# EAGLE design rf-gateway (EAGLE 9.6.2)
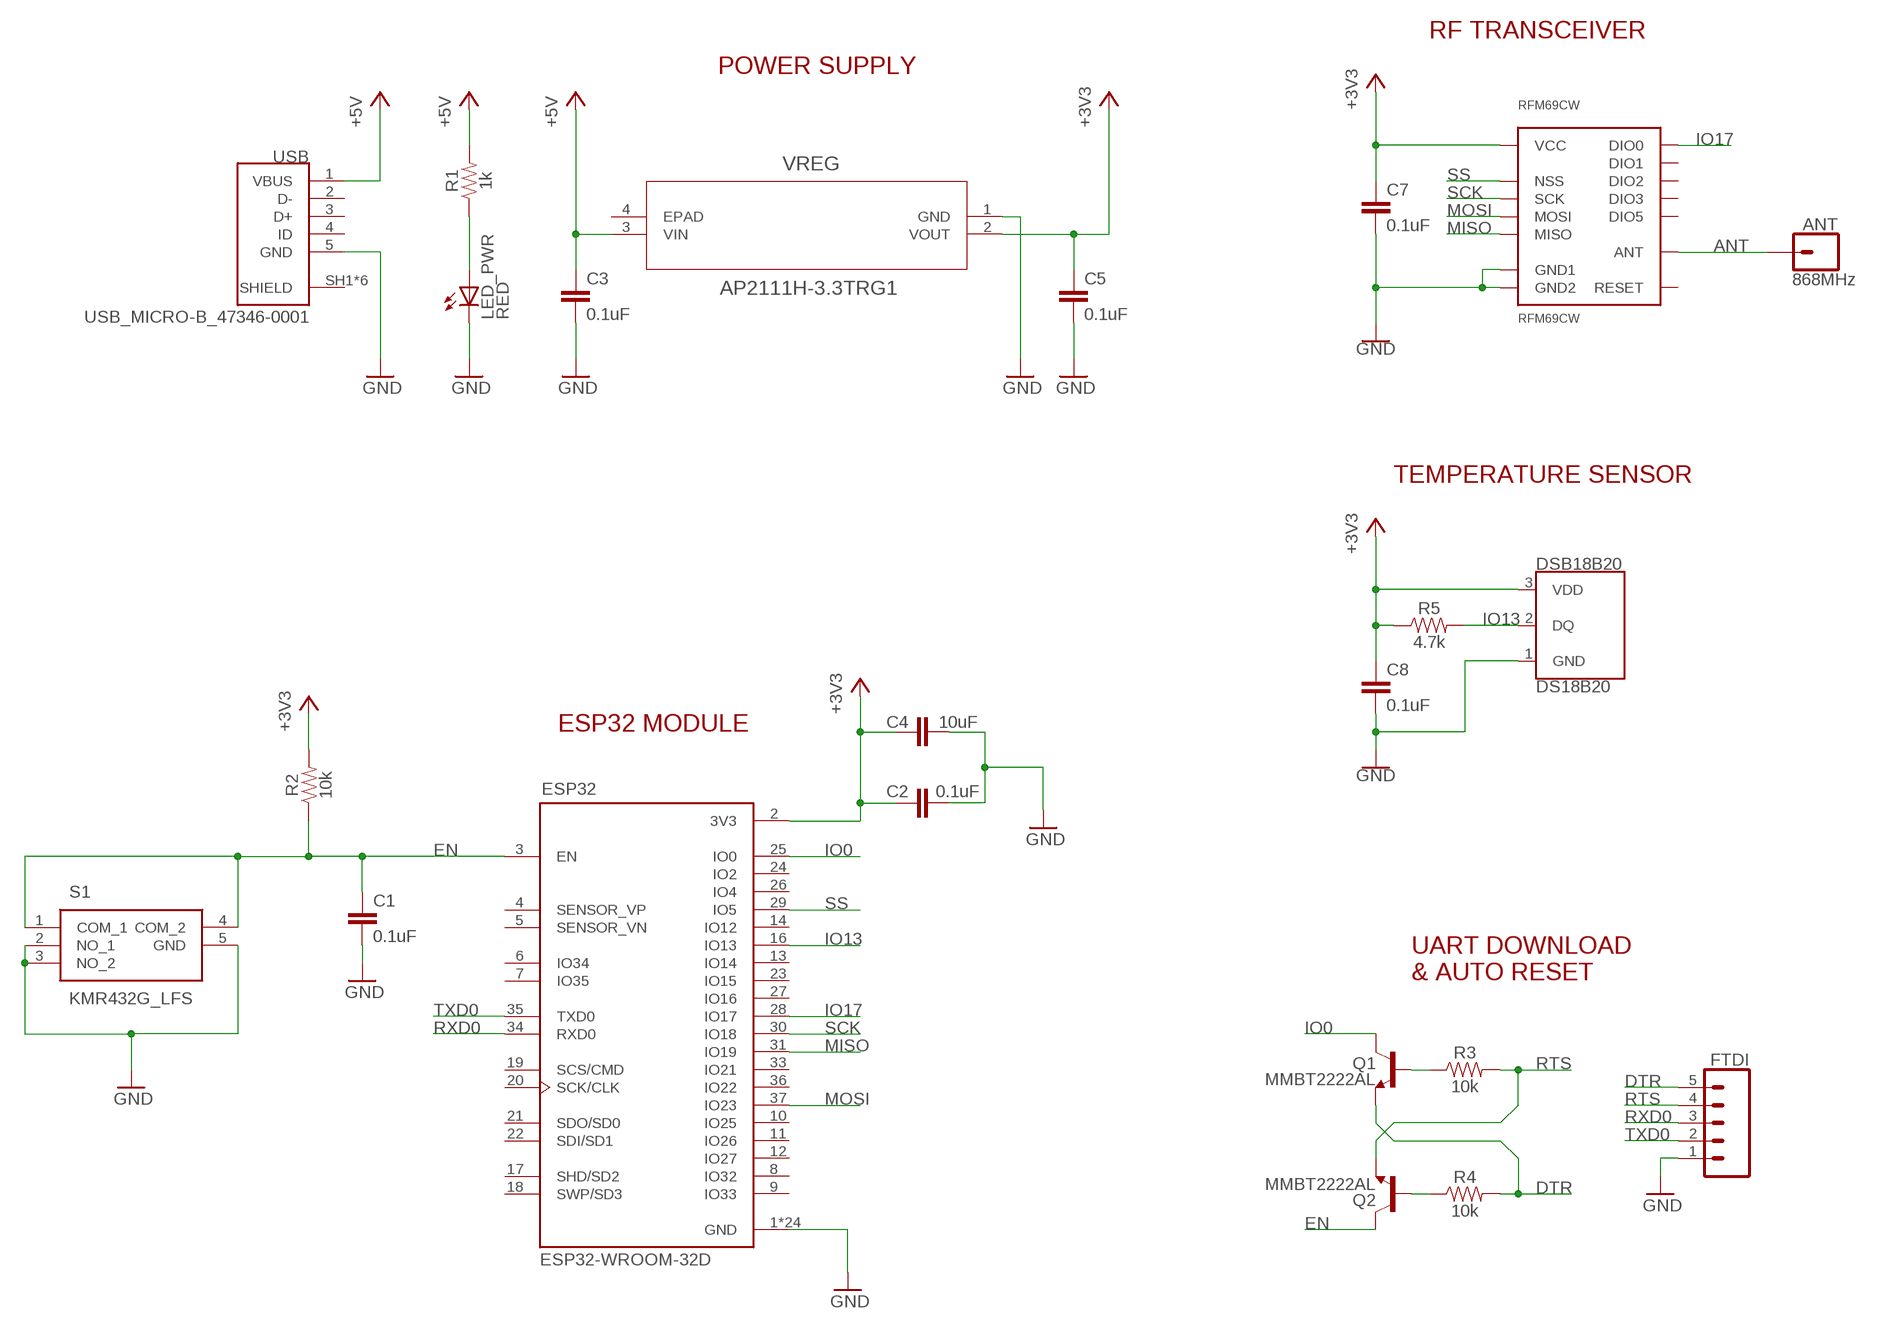
[diagram p0: schematic, sheet 1]

## Parts
ANT  868MHz  CONN_01  [1X01]
C1  0.1uF  0.1UF-0603-25V-5%  [0603]
C2  0.1uF  0.1UF-0603-25V-5%  [0603]
C3  0.1uF  0.1UF-0603-25V-5%  [0603]
C4  10uF  10UF-0805-10V-10%  [0805]
C5  0.1uF  0.1UF-0603-25V-5%  [0603]
C7  0.1uF  0.1UF-0603-25V-5%  [0603]
C8  0.1uF  0.1UF-0603-25V-5%  [0603]
DSB18B20  DS18B20  [TO-92-AMMO]
ESP32  ESP32-WROOM-32D  [ESP32-WROOM-32D]
FTDI  CONN_05  [1X05]
LED_PWR  RED  LEDCHIPLED_0805  [CHIPLED_0805]
Q1  MMBT2222AL  TRANS_NPN-MMBT2222AL  [SOT23-3]
Q2  MMBT2222AL  TRANS_NPN-MMBT2222AL  [SOT23-3]
R1  1k  1KOHM-0603-1/10W-1%  [0603]
R2  10k  10KOHM-0603-1/10W-1%  [0603]
R3  10k  10KOHM-0603-1/10W-1%  [0603]
R4  10k  10KOHM-0603-1/10W-1%  [0603]
R5  4.7k  4.7KOHM-0603-1/10W-1%  [0603]
RFM69CW  RFM69CW  [RFM69CW]
S1  KMR432G_LFS  [KMR421GULCLFS]
USB  USB_MICRO-B_47346-0001  [MOLEX_47346-0001]
VREG  AP2111H-3.3TRG1  [SOT-223_DIO]

## Nets
+3V3: C2.1 C4.1 C5.1 C7.1 C8.1 DSB18B20.3(VDD) ESP32.2(3V3) R2.2 R5.1 RFM69CW.VDD(VCC) VREG.2(VOUT)
+5V: C3.1 R1.2 USB.1(VBUS) VREG.3(VIN)
ANT: ANT.1 RFM69CW.ANT
DTR: FTDI.5 Q1.2(E) R4.2
EN: C1.1 ESP32.3(EN) Q2.3(C) R2.1 S1.1(COM_1) S1.4(COM_2)
GND: C1.2 C2.2 C3.2 C4.2 C5.2 C7.2 C8.2 DSB18B20.1(GND) ESP32.1(GND) ESP32.15(GND) ESP32.38(GND) ESP32.39_1(GND) ESP32.39_2(GND) ESP32.39_3(GND) ESP32.39_4(GND) ESP32.39_5(GND) ESP32.39_6(GND) ESP32.39_7(GND) ESP32.39_8(GND) ESP32.39_9(GND) ESP32.39_10(GND) ESP32.39_11(GND) ESP32.39_12(GND) ESP32.39_13(GND) ESP32.39_14(GND) ESP32.39_15(GND) ESP32.39_16(GND) ESP32.39_17(GND) ESP32.39_18(GND) ESP32.39_19(GND) ESP32.39_20(GND) ESP32.39_21(GND) FTDI.1 LED_PWR.C RFM69CW.GND@1(GND1) RFM69CW.GND@2(GND2) S1.2(NO_1) S1.3(NO_2) S1.5(GND) USB.5(GND) VREG.1(GND)
IO0: ESP32.25(IO0) Q1.3(C)
IO13: DSB18B20.2(DQ) ESP32.16(IO13) R5.2
IO17: ESP32.28(IO17) RFM69CW.DIO0
MISO: ESP32.31(IO19) RFM69CW.MISO
MOSI: ESP32.37(IO23) RFM69CW.MOSI
N$1: LED_PWR.A R1.1
N$2: Q1.1(B) R3.1
N$3: Q2.1(B) R4.1
RTS: FTDI.4 Q2.2(E) R3.2
RXD0: ESP32.34(RXD0) FTDI.3
SCK: ESP32.30(IO18) RFM69CW.SCK
SS: ESP32.29(IO5) RFM69CW.NSS
TXD0: ESP32.35(TXD0) FTDI.2
Unconnected: ESP32.4(SENSOR_VP) ESP32.5(SENSOR_VN) ESP32.6(IO34) ESP32.7(IO35) ESP32.8(IO32) ESP32.9(IO33) ESP32.10(IO25) ESP32.11(IO26) ESP32.12(IO27) ESP32.13(IO14) ESP32.14(IO12) ESP32.17(SHD/SD2) ESP32.18(SWP/SD3) ESP32.19(SCS/CMD) ESP32.20(SCK/CLK) ESP32.21(SDO/SD0) ESP32.22(SDI/SD1) ESP32.23(IO15) ESP32.24(IO2) ESP32.26(IO4) ESP32.27(IO16) ESP32.33(IO21) ESP32.36(IO22) RFM69CW.DIO1 RFM69CW.DIO2 RFM69CW.DIO3 RFM69CW.DIO5 RFM69CW.RESET USB.2(D-) USB.3(D+) USB.4(ID) USB.SH1(SHIELD) USB.SH2(SHIELD) USB.SH3(SHIELD) USB.SH4(SHIELD) USB.SH5(SHIELD) USB.SH6(SHIELD) VREG.4(EPAD)

## Notes on the sheet
- RF TRANSCEIVER
- POWER SUPPLY
- TEMPERATURE SENSOR
- ESP32 MODULE
- UART DOWNLOAD
  & AUTO RESET

## Library data of the parts
ANT = SparkFun-Connectors:CONN_01: Single connection point. Often used as Generic Header-pin footprint for 0.1 inch spaced/style header connections On any of the 0.1 inch spaced packages, you can populate with these: Break Away Headers - Straight <https://www.sparkfun.com/products/116> (PRT-00116) Break Away Male Headers - Right Angle <https://www.sparkfun.com/products/553> (PRT-00553) Female Headers <https://www.sparkfun.com/products/115> (PRT-00115) Break Away Headers - Machine Pin <https://www.sparkfun.com/products/117> (PRT-00117) Break Away Female Headers - Swiss Machine Pin <https://www.sparkfun.com/products/743> (PRT-00743) This device is also useful as a general connection point to wire up your design to another part of your project. Our various solder wires solder well into these plated through hole pads. Hook-Up Wire - Assortment (Stranded, 22 AWG) <https://www.sparkfun.com/products/11375> (PRT-11375) Hook-Up Wire - Assortment (Solid Core, 22 AWG) <https://www.sparkfun.com/products/11367> (PRT-11367) View the entire wire category on our website here <https://www.sparkfun.com/categories/141> Special notes: SMTSO-256-ET is a "flush mount" nut for a 4-40 screw. We mostly use this on specialty testbeds; it is a nice way to connect hardware to your PCB at an adjustable hieght. Also note, the SNAP packages are for using a snappable style connector. We sell a baggie of snaps and they are also used on two LilyPad designs: Snap Assortment - 30 pack (male and female) <https://www.sparkfun.com/products/11347> (DEV-11347) LilyPad Arduino SimpleSnap <https://www.sparkfun.com/products/10941> (DEV-10941) LilyPad SimpleSnap Protoboard <https://www.sparkfun.com/products/10940> (DEV-10940)
C1-C3 C5 C7 C8 = SparkFun-Capacitors:0.1UF: 0.1µF ceramic capacitors A capacitor is a passive two-terminal electrical component used to store electrical energy temporarily in an electric field.; PROD_ID: CAP-08604
C4 = SparkFun-Capacitors:10UF: 10.0µF ceramic capacitors A capacitor is a passive two-terminal electrical component used to store electrical energy temporarily in an electric field.; PROD_ID: CAP-11330
DSB18B20 = SparkFun-Sensors:DS18B20: Dallas/Maxim DS18B20 1-Wire Temperature Sensor The DS18B20 reports degrees C with 9 to 12-bit precision, -55C to 125C (+/-0.5C). Each sensor has a unique 64-Bit Serial number etched into it - allows for a huge number of sensors to be used on one data bus. Datasheet <http://datasheets.maximintegrated.com/en/ds/DS18B20.pdf> SparkFun Products One Wire Digital Temperature Sensor - DS18B20 <https://www.sparkfun.com/products/245> (SEN-00245); STORE_ID: SEN-00245
ESP32 = IC-Microcontroller:ESP32-WROOM-32D: Bluetooth, WiFi 802.11b/g/n, Bluetooth v4.2 + EDR, Class 1, 2 and 3 Transceiver Module 2.4GHz ~ 2.5GHz Integrated, Trace Surface Mount; AVAILABILITY: Unavailable; DESCRIPTION: Bluetooth, WiFi 802.11b/g/n, Bluetooth v4.2 + EDR, Class 1, 2 and 3 Transceiver Module 2.4GHz ~ 2.5GHz Integrated, Trace Surface Mount; MF: Espressif Systems; MP: ESP32-WROOM-32D; PACKAGE: Module Espressif Systems; PRICE: None
FTDI = SparkFun-Connectors:CONN_05: Multi connection point. Often used as Generic Header-pin footprint for 0.1 inch spaced/style header connections On any of the 0.1 inch spaced packages, you can populate with these: Break Away Headers - Straight <https://www.sparkfun.com/products/116> (PRT-00116) Break Away Male Headers - Right Angle <https://www.sparkfun.com/products/553> (PRT-00553) Female Headers <https://www.sparkfun.com/products/115> (PRT-00115) Break Away Headers - Machine Pin <https://www.sparkfun.com/products/117> (PRT-00117) Break Away Female Headers - Swiss Machine Pin <https://www.sparkfun.com/products/743> (PRT-00743) For SCREWTERMINALS and SPRING TERMINALS visit here: Screw Terimnals on SparkFun.com <https://www.sparkfun.com/search/results?term=Screw+Terminals> (5mm/3.5mm/2.54mm spacing) This device is also useful as a general connection point to wire up your design to another part of your project. Our various solder wires solder well into these plated through hole pads. Hook-Up Wire - Assortment (Stranded, 22 AWG) <https://www.sparkfun.com/products/11375> (PRT-11375) Hook-Up Wire - Assortment (Solid Core, 22 AWG) <https://www.sparkfun.com/products/11367> (PRT-11367) View the entire wire category on our website here <https://www.sparkfun.com/categories/141> Special notes: Molex polarized connector foot print use with SKU : PRT-08231 with associated crimp pins and housings. 1MM SMD Version SKU: PRT-10208
LED_PWR = adafruit:LED: LED OSRAM: - CHIPLED LG R971, LG N971, LY N971, LG Q971, LY Q971, LO R971, LY R971 LH N974, LH R974 LS Q976, LO Q976, LY Q976 LO Q996 - Hyper CHIPLED LW Q18S LB Q993, LB Q99A, LB R99A - SideLED LS A670, LO A670, LY A670, LG A670, LP A670 LB A673, LV A673, LT A673, LW A673 LH A674 LY A675 LS A676, LA A676, LO A676, LY A676, LW A676 LS A679, LY A679, LG A679 - Hyper Micro SIDELED® LS Y876, LA Y876, LO Y876, LY Y876 LT Y87S - SmartLED LW L88C, LW L88S LB L89C, LB L89S, LG L890 LS L89K, LO L89K, LY L89K LS L896, LA L896, LO L896, LY L896 - TOPLED LS T670, LO T670, LY T670, LG T670, LP T670 LSG T670, LSP T670, LSY T670, LOP T670, LYG T670 LG T671, LOG T671, LSG T671 LB T673, LV T673, LT T673, LW T673 LH T674 LS T676, LA T676, LO T676, LY T676, LB T676, LH T676, LSB T676, LW T676 LB T67C, LV T67C, LT T67C, LS T67K, LO T67K, LY T67K, LW E67C LS E67B, LA E67B, LO E67B, LY E67B, LB E67C, LV E67C, LT E67C LW T67C LS T679, LY T679, LG T679 LS T770, LO T770, LY T770, LG T770, LP T770 LB T773, LV T773, LT T773, LW T773 LH T774 LS E675, LA E675, LY E675, LS T675 LS T776, LA T776, LO T776, LY T776, LB T776 LHGB T686 LT T68C, LB T68C - Hyper Mini TOPLED® LB M676 - Mini TOPLED Santana® LG M470 LS M47K, LO M47K, LY M47K Source: http://www.osram.convergy.de/
Q1 Q2 = SparkFun-DiscreteSemi:TRANS_NPN: NPN transistor Current controlled devices typically used to amplify current or used as a switch. BC547 - COM-08928 <http://www.sparkfun.com/products/8928> (TO-92 45V 100mA) (1.Collector 2.Base 3.Emitter) 2N3904 - COM-00521 <http://www.sparkfun.com/products/521> (TO-92 40V 200mA) (1.Emitter 2.Base 3.Collector) P2N2222A - COM-12852 <http://www.sparkfun.com/products/12852> (TO-92 40V 600mA) (1.Collector 2.Base 3.Emitter); PROD_ID: TRANS-08049; VALUE: 600mA/40V
R1 = SparkFun-Resistors:1KOHM: 1kΩ resistor A resistor is a passive two-terminal electrical component that implements electrical resistance as a circuit element. Resistors act to reduce current flow, and, at the same time, act to lower voltage levels within circuits. - Wikipedia; PROD_ID: RES-07856
R2-R4 = SparkFun-Resistors:10KOHM: 10kΩ resistor A resistor is a passive two-terminal electrical component that implements electrical resistance as a circuit element. Resistors act to reduce current flow, and, at the same time, act to lower voltage levels within circuits. - Wikipedia; PROD_ID: RES-00824
R5 = SparkFun-Resistors:4.7KOHM: 4.7kΩ resistor A resistor is a passive two-terminal electrical component that implements electrical resistance as a circuit element. Resistors act to reduce current flow, and, at the same time, act to lower voltage levels within circuits. - Wikipedia; PROD_ID: RES-07857
RFM69CW = kanflo:RFM69CW: HopeRFs RFM69CW with all digital IOs available.
S1 = Oyvind:KMR432G_LFS: SWITCH TACTILE SPST-NO 0.05A 32V Source: Datasheet <https://www.mouser.com/datasheet/2/60/kmr4-1382752.pdf>; ARROW_PART_NUMBER: KMR432G LFS; ARROW_PRICE-STOCK: https://www.arrow.com/en/products/kmr432glfs/ck?region=nac; DESCRIPTION: SWITCH TACTILE SPST-NO 0.05A 32V; HEIGHT: 2.5mm; MANUFACTURER_NAME: C & K COMPONENTS; MANUFACTURER_PART_NUMBER: KMR432G LFS; MOUSER_PART_NUMBER: 611-KMR432GLFS
USB = Connectors:USB_MICRO-B_47346-0001: CONN RCPT 5POS MICRO USB R/A SMD; AVAILABILITY: Unavailable; DESCRIPTION: USB - micro B USB 2.0 Receptacle Connector 5 Position Surface Mount, Right Angle; MF: Molex; MOUSER-PURCHASE-URL: https://snapeda.com/shop?store=Mouser&id=53503; MP: 47346-0001; PACKAGE: None; PRICE: None
VREG = IC-Power:AP2111H-3.3TRG1; BUILT_BY: EMA_UL_Team; MANUFACTURER_PART_NUMBER: AP2111H-3.3TRG1; SOURCELIBRARY: DIODESINC_2_2015-08-18; VENDOR: Diodes Inc

## Board
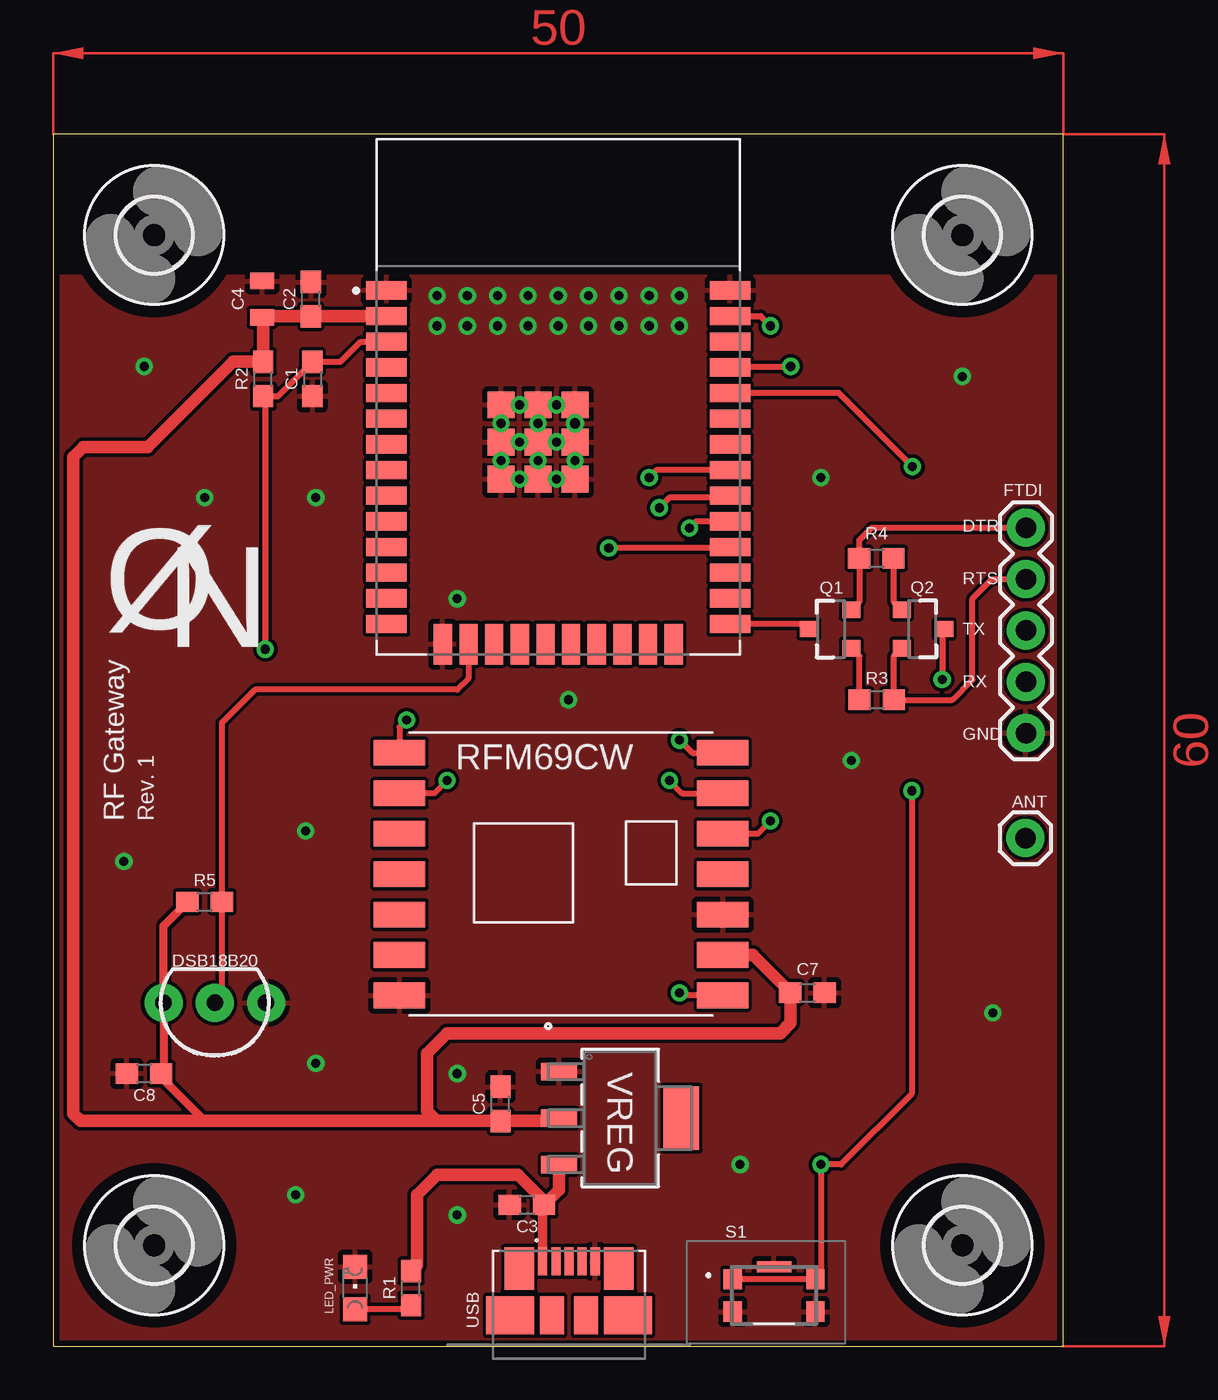
[diagram p1: board, top side]
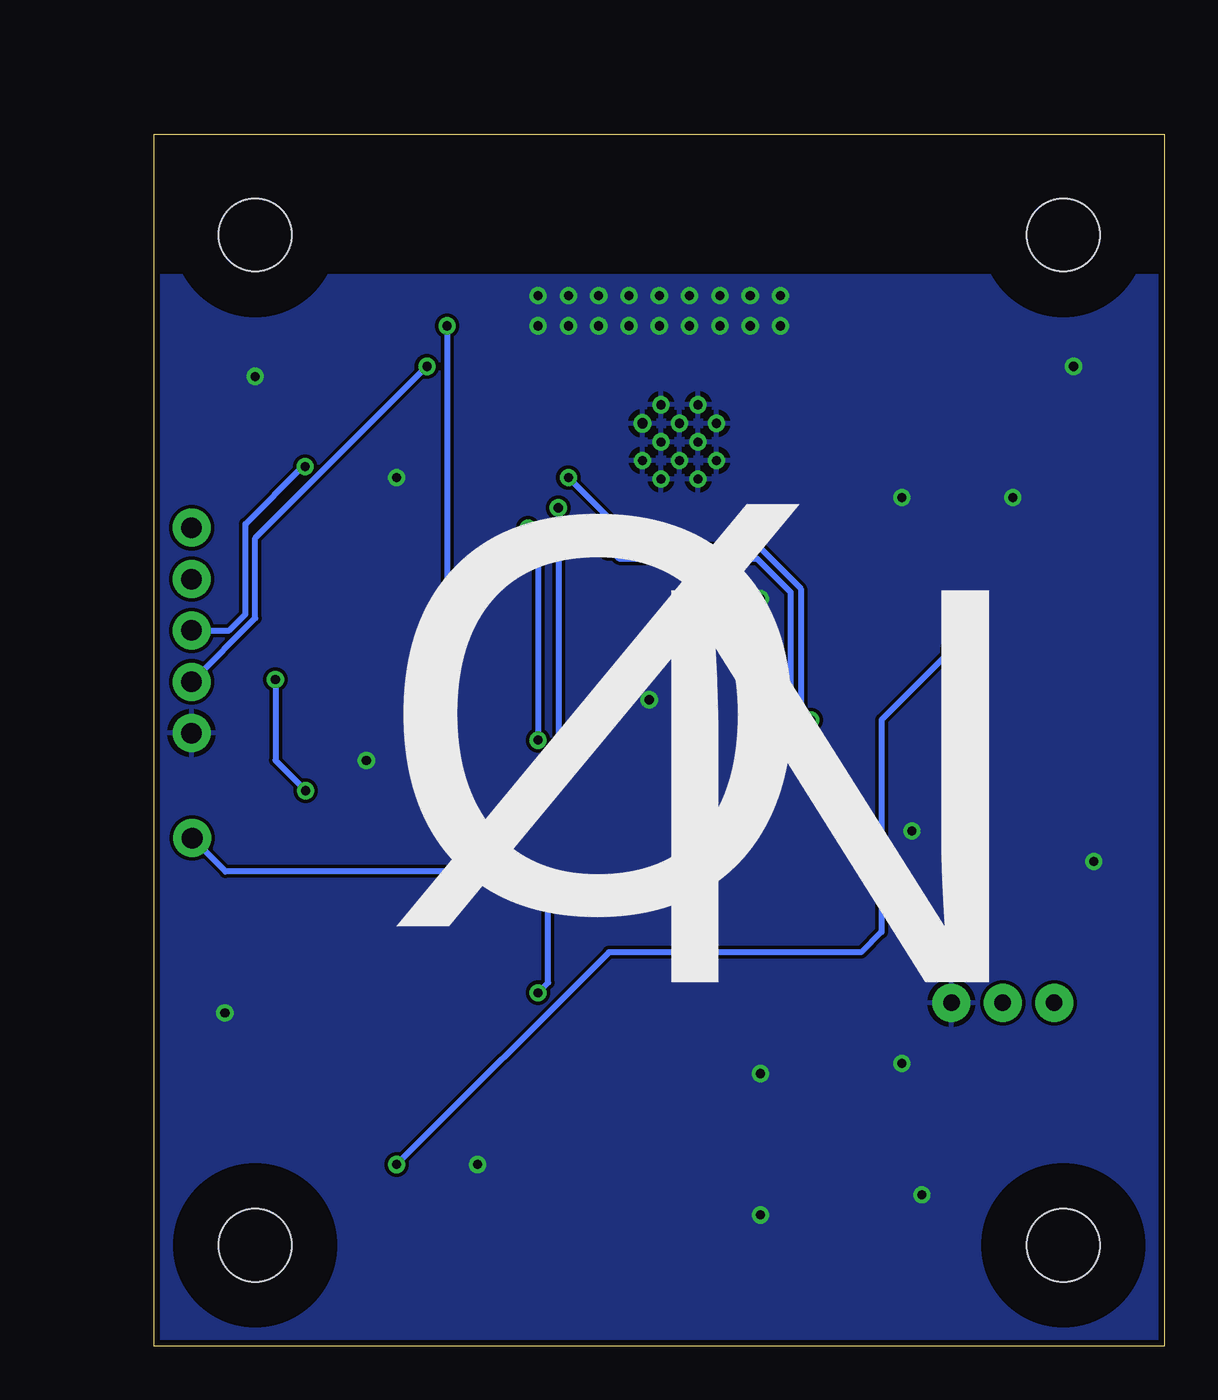
[diagram p2: board, bottom side, seen from below]

Size 50 x 60 mm. Coordinates in mm from the lower left corner, seen from the top.
Outline: 0,0 50,0 50,60 0,60 0,0
Copper layers (1*16): Top 0.035mm / dielectric 1.5mm / Bottom 0.035mm
Design rules "aisler_2_layer_simple": minimum track width 0.2mm, minimum drill 0.45mm, track to track 0.175mm, track to pad 0.175mm, pad to pad 0.175mm, via to via 0.175mm, smd to smd 0.175mm, copper to edge 0.3mm, drill to drill 0.25mm, minimum pad ring 0.2mm, minimum via ring 0.2mm, stop-mask expansion 0mil, vias tented up to drill 0mil, thermal gap 10mil

### Footprints (pad centres in the part's own frame; a part is rotated, then mirrored left to right if it is on the bottom)
1X01 = drill 1.016 pad 1.88: 1 0,0
0603 = smd 1.1 x 1: 1 -0.85,0; 2 0.85,0
0805 = smd 0.8 x 1.2: 1 -0.9,0; 2 0.9,0
TO-92-AMMO = drill 0.813 pad 1.88: 1 -2.54,0; 2 0,0; 3 2.54,0
ESP32-WROOM-32D = smd 2 x 0.9: 1 -8.5,5.26; 2 -8.5,3.99; 3 -8.5,2.72; 4 -8.5,1.45; 5 -8.5,0.18; 6 -8.5,-1.09; 7 -8.5,-2.36; 8 -8.5,-3.63; 9 -8.5,-4.9; 10 -8.5,-6.17; 11 -8.5,-7.44; 12 -8.5,-8.71; 13 -8.5,-9.98; 14 -8.5,-11.25; 25 8.5,-11.25; 26 8.5,-9.98; 27 8.5,-8.71; 28 8.5,-7.44; 29 8.5,-6.17; 30 8.5,-4.9; 31 8.5,-3.63; 32 8.5,-2.36; 33 8.5,-1.09; 34 8.5,0.18; 35 8.5,1.45; 36 8.5,2.72; 37 8.5,3.99; 38 8.5,5.26 | smd 0.9 x 2: 15 -5.715,-12.25; 16 -4.445,-12.25; 17 -3.175,-12.25; 18 -1.905,-12.25; 19 -0.635,-12.25; 20 0.635,-12.25; 21 1.905,-12.25; 22 3.175,-12.25; 23 4.445,-12.25; 24 5.715,-12.25 | smd 1.33 x 1.33: 39_1 -2.835,-0.405; 39_2 -1,-0.405; 39_3 0.835,-0.405; 39_4 -2.835,-2.24; 39_5 -1,-2.24; 39_6 0.835,-2.24; 39_7 -2.835,-4.075; 39_8 -1,-4.075; 39_9 0.835,-4.075 | drill 0.45: 39_10 -1.917,-0.405; 39_11 -0.083,-0.405; 39_12 -2.835,-1.323; 39_13 -1,-1.323; 39_15 -1.917,-2.24; 39_16 -0.083,-2.24; 39_17 -2.835,-3.158; 39_18 -1,-3.158; 39_19 0.835,-3.158; 39_20 -1.917,-4.075; 39_21 -0.083,-4.075 | drill 0.5: 39_14 0.835,-1.323
1X05 = drill 1.016 pad 1.88: 1 0,0; 2 2.54,0; 3 5.08,0; 4 7.62,0; 5 10.16,0
CHIPLED_0805 = smd 1.2 x 1.2: A 0,-1.05; C 0,1.05
SOT23-3 = smd 0.8 x 0.9: 1 -0.95,-1; 2 0.95,-1; 3 0,1.1
RFM69CW = smd 2.54 x 1.27: ANT 8,-6; DIO0 -8,4; DIO1 -8,0; DIO2 -8,2; DIO3 8,0; DIO5 -8,-2; GND@1 8,-2; GND@2 -8,-6; MISO -8,6; MOSI 8,2; NSS 8,6; RESET -8,-4; SCK 8,4; VDD 8,-4
KMR421GULCLFS = smd 0.9 x 1: 1 -2.05,0.8; 2 -2.05,-0.8; 3 2.05,-0.8; 4 2.05,0.8 | smd 1.7 x 0.55: 5 0,1.425
3,6 = hole 3.6: 0,0
MOLEX_47346-0001 = smd 0.45 x 1.38: 1 -1.3,2.66; 2 -0.65,2.66; 3 0,2.66; 4 0.65,2.66; 5 1.3,2.66 | smd 1.475 x 2.1: SH1 -2.462,2.3; SH2 2.462,2.3 | smd 2.375 x 1.9: SH3 -2.913,0; SH6 2.913,0 | smd 1.175 x 1.9: SH4 -0.838,0; SH5 0.838,0
SOT-223_DIO = smd 0.851 x 1.761: 1 -2.3,-3.025; 2 0,-3.025; 3 2.3,-3.025 | smd 3.151 x 1.761: 4 0,3.025

### Placement (x,y rotation side)
ANT  48.12,25.15 0 top
C1  12.83,47.88 270 top
C2  12.76,51.83 90 top
C3  23.45,7 180 top
C4  10.34,51.83 90 top
C5  22.14,12 90 top
C7  37.33,17.5 0 top
C8  4.5,13.5 180 top
DSB18B20  8,17 180 top
ESP32  25,47 0 top
FTDI  48.15,30.35 90 top
LED_PWR  14.94,2.88 0 top
Q1  38.5,35.5 90 top
Q2  43,35.5 270 top
R1  17.71,2.88 90 top
R2  10.4,47.88 90 top
R3  40.76,32 0 top
R4  40.74,39 180 top
R5  7.5,22 0 top
RFM69CW  25.14,23.37 0 top
S1  35.68,2.52 0 top
U$1  [3,6]  5,55 0 top
U$2  [3,6]  45,55 0 top
U$3  [3,6]  45,5 0 top
U$4  [3,6]  5,5 0 top
USB  25.53,1.54 0 top
VREG  28.06,11.3 270 top

### Tracks (layer width: path | path; a pad name or v marks a point on that pad's centre or on a via)
+3V3
  Top 0.406: VREG.2 24.89,11.15 | C2.1 12.78,50.99 | 10.39,50.98 C4.1 10.4,50.87 | 7.5,11.15 5.35,13.3 C8.1 5.46,13.61 DSB18B20.3 5.46,20.81 R5.1 | 36.48,17.52 C7.1 36.5,17.48
  Top 0.61: 24.89,11.15 C5.1 19,11.15 | 19,11.15 7.5,11.15 1.35,11.15 1,11.5 1,44 1.5,44.5 4.67,44.5 8.9,48.73 R2.2 10.4,50.87 | ESP32.2 12.78,50.99 | C2.1 10.39,50.98 | RFM69CW.VDD 34.63,19.37 36.48,17.52 | 36.5,17.48 36.5,16 36,15.5 19.5,15.5 18.5,14.5 18.5,11.65 19,11.15
+5V
  Top 0.406: 18,4.02 R1.2 | C3.1 24.3,7.2
  Top 0.47: USB.1 24.23,6.93
  Top 0.508: 24.23,6.93 C3.1
  Top 0.61: C3.1 25.04,7.74 VREG.3 | 24.3,7.2 23,8.5 19,8.5 18,7.5 18,4.02
ANT  (via drill 0.45)
  Top 0.305: RFM69CW.ANT 31.13,17.37 v31,17.5
  Bottom 0.305: v31,17.5 30.5,18 30.5,22 32,23.5 46.47,23.5 ANT.1
DTR
  Top 0.305: Q1.2 39.89,36.84 R4.2 39.89,39.89 40.51,40.51 FTDI.5
EN  (via drill 0.45)
  Top 0.305: ESP32.3 15.22,49.72 14.22,48.73 C1.1 11.13,47.02 R2.1 10.5,46.92 v10.5,34.5 | S1.1 S1.4 38,3.59 v38,9 39,9 42.5,12.5 v42.5,27.5 | Q2.3 44,35.4 v44,33
  Bottom 0.305: v10.5,34.5 14,31 14,20.5 15,19.5 27.5,19.5 v38,9 | v44,33 44,29 v42.5,27.5
GND  (via drill 0.45)
  other vias: 4.5,48.5 45,48 7.5,42 12.5,25.5 12,7.5 34,9 46.5,16.5 25.5,32 13,42 3.5,24 39.5,29 20,13.5 13,14 20,6.5 38,43 19,52 20,37 31,52 20.5,52 22,52 23.5,52 25,52 26.5,52 28,52 29.5,52 19,50.5 20.5,50.5 22,50.5 23.5,50.5 25,50.5 26.5,50.5 28,50.5 29.5,50.5 31,50.5
  pour Top: 0,53 50,53 50,0 0,0
  pour Bottom: 0,53 50,53 50,0 0,0
IO0
  Top 0.305: Q1.3 37.15,35.75 ESP32.25
IO13
  Top 0.305: ESP32.16 20.55,33.05 20,32.5 10,32.5 8.35,30.85 R5.2 8.35,17.35 DSB18B20.2
IO17  (via drill 0.45)
  Top 0.305: ESP32.28 33.44,39.5 v27.5,39.5 | v19.5,28 18.87,27.37 RFM69CW.DIO0
  Bottom 0.305: v27.5,39.5 27,39 20.18,39 18.5,37.32 18.5,31 19.5,30 v19.5,28
MISO  (via drill 0.45)
  Top 0.305: ESP32.31 29.87,43.37 v29.5,43 | v17.5,31 17.14,30.64 RFM69CW.MISO
  Bottom 0.305: v29.5,43 26,39.5 20,39.5 18,37.5 18,31.5 v17.5,31
MOSI  (via drill 0.45)
  Top 0.305: ESP32.37 35.01,50.99 v35.5,50.5 | v35.5,26 34.87,25.37 RFM69CW.MOSI
  Bottom 0.305: v35.5,50.5 v35.5,26
N$1
  Top 0.305: 17.51,1.83 LED_PWR.A
  Top 0.508: R1.1 17.51,1.83
N$2
  Top 0.305: R3.1 39.91,34.14 Q1.1
N$3
  Top 0.305: R4.1 41.59,36.86 Q2.1
RTS
  Top 0.305: Q2.2 41.61,34.16 R3.2 44.5,32 45.5,33 45.5,37 46.47,37.97 FTDI.4
RXD0  (via drill 0.45)
  Top 0.305: v42.53,43.53 38.88,47.18 ESP32.34
  Bottom 0.305: FTDI.3 46.29,35.43 45.48,36.24 45.48,40.7 42.65,43.53 v42.53,43.53
SCK  (via drill 0.45)
  Top 0.305: ESP32.30 33.4,42 30.5,42 v30,41.5 | v30.5,28 31.13,27.37 RFM69CW.SCK
  Bottom 0.305: v30,41.5 30,28.5 v30.5,28
SS  (via drill 0.45)
  Top 0.305: ESP32.29 31.83,40.83 v31.5,40.5 | v31,30 31.63,29.37 RFM69CW.NSS
  Bottom 0.305: v31.5,40.5 31,40 v31,30
TXD0  (via drill 0.45)
  Top 0.305: v36.5,48.5 36.45,48.45 ESP32.35
  Bottom 0.305: FTDI.2 45,36.04 45,40 v36.5,48.5
(copper drawn outside any net)
  shapes: Top area x2

### Text on the board
tNames: DTR | RTS | Ø | N | TX | RX | GND | RF Gateway | Rev. 1
bNames: Ø | N